# Altium project Altium.PrjPcb
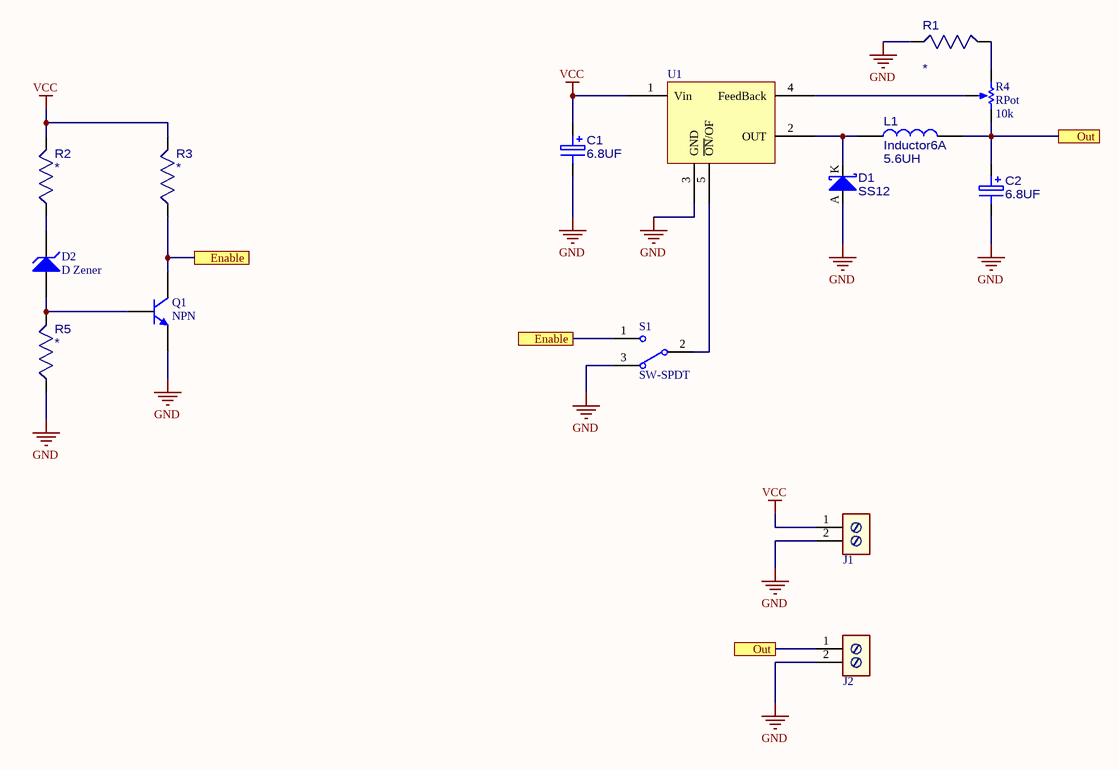
[diagram p0: Sheet1.SchDoc]
1 sheet, 15 parts. Net scope: flat (ports and power ports of the same name join across sheets).
Board file: PCB1.PcbDoc

## Sheet Sheet1.SchDoc
size A4

### Parts
C1  6.8UF  [RADPOL8X11]
C2  6.8UF  [RADPOL8X11]
D1  value SS12  [DIO_PTH_5MM]  (hidden comment: DIODE - SCHOTTKY)
D2  D Zener  [DIODE-0.7]
J1  2-Ways Wire-to-Board Horizontal  [KF128 2P]  (value not drawn)
J2  2-Ways Wire-to-Board Horizontal  [KF128 2P]  (value not drawn)
L1  5.6UH  [Inductor6A]
Q1  NPN  [TO-226-AA]
R1  *  [RES-7.62mm]
R2  *  [RES-7.62mm]
R3  *  [RES-7.62mm]
R4  RPot  value 10k  [VR5]
R5  *  [RES-7.62mm]
S1  SW-SPDT  [Pin Header 3 Ways]
U1  LM2576HV 5.0  [LM2576-TO220]  (value not drawn)

### Ports
Enable, Out

### Nets
GND: C1.2 C2.2 D1.A J1.2 J2.2 Q1.3(E) R1.1 R5.1 S1.3 U1.3(GND)
VCC: C1.1 J1.1 R2.2 R3.2 U1.1(Vin)
NetC2_1: C2.1 J2.1 L1.2 R4.2(BOT) ; port Out
NetD1_K: D1.K L1.1 U1.2(OUT)
NetD2_1: D2.1(A) Q1.2(B) R5.2
NetD2_2: D2.2(K) R2.1
NetQ1_1: Q1.1(C) R3.1 S1.1 ; port Enable
NetR1_2: R1.2 R4.1(TOP)
NetR4_3: R4.3(TAP) U1.4(FeedBack)
NetS1_2: S1.2 U1.5(~{ON}/OF)

### Library data of the parts
C1 C2 = ELECTRO1_1: Value: 6.8UF
D1 = DIODE - SCHOTTKY: Schottky Diode; Digikey part number: SS12E-TPMSCT-ND; Digikey price 1x: 0.70; Digikey price 100x: 0.224
D2 = D Zener: Zener Diode; Published: 8-Jun-2000; LatestRevisionDate: 17-Jul-2002; LatestRevisionNote: Re-released for DXP Platform.; PackageReference: DIODE-0.7; Publisher: Altium Limited; PackageDescription: Diode, Thru-Hole; 2 Leads; 0.7 in Pin Spacing
J1 J2 = KF128 2P: 2 Position Wire to Board Terminal Block Horizontal with Board 0.200" (5.08mm) Through Hole; Manufacturer 1: Amphenol Anytek; Manufacturer 1 PN: VI0221520000G; ComponentLink1Description: Datasheet; ComponentLink1URL: http://www.on-shore.com/wp-content/uploads/2015/09/OSTTAXX4163.pdf; Digikey PN: 609-3936-ND; Mouser PN: 649-VI02215200J0G
L1 = IND_1: FIXED IND 5.6UH 6A 14.4 MOHM SMD; ClassName: REG_3; Digikey: 732-4107-1-ND; Value: 5.6UH
Q1 = NPN: NPN Bipolar Transistor; Published: 8-Jun-2000; LatestRevisionDate: 17-Jul-2002; LatestRevisionNote: Re-released for DXP Platform.; PackageReference: TO-226-AA; Publisher: Altium Limited; PackageDescription: TO, Flat Index; 3 In-Line, Axial Leads; Body Dia. 4.8mm; Leads 0.55 x 0.51 mm (max); Code_JEDEC: TO-226-AA
R1-R3 R5 = RES_PTH300: Pin Through Hole Resistor 300mils/7.62mm; Footprint: RES_PTH300; Value: *
R4 = RPot: Potentiometer; Sim Note: Enter the Resistance value and the set point into parameter fields.; Set Position: 0.5; Published: 8-Jun-2000; LatestRevisionDate: 17-Jul-2002; LatestRevisionNote: Re-released for DXP Platform.; PackageReference: VR5; Publisher: Altium Limited; PackageDescription: Variable Resistor, Thru-Hole; 3 Leads
S1 = SW-SPDT: SPDT Subminiature Toggle Switch, Right Angle Mounting, Vertical Actuation; Published: 24-Mar-1999; LatestRevisionDate: 17-Dec-2003; LatestRevisionNote: Schematic revised, PCB Footprint replaced.; DatasheetVersion: 05-Dec-2000; PackageReference: TL36WW15050; Publisher: Altium Limited; PackageDescription: Switch; 4 Leads; ComponentLink1Description: Manufacturer Link; ComponentLink1URL: http://www.apem.com
U1 = LM2576